# Altium project EM-Lite.PrjPcb
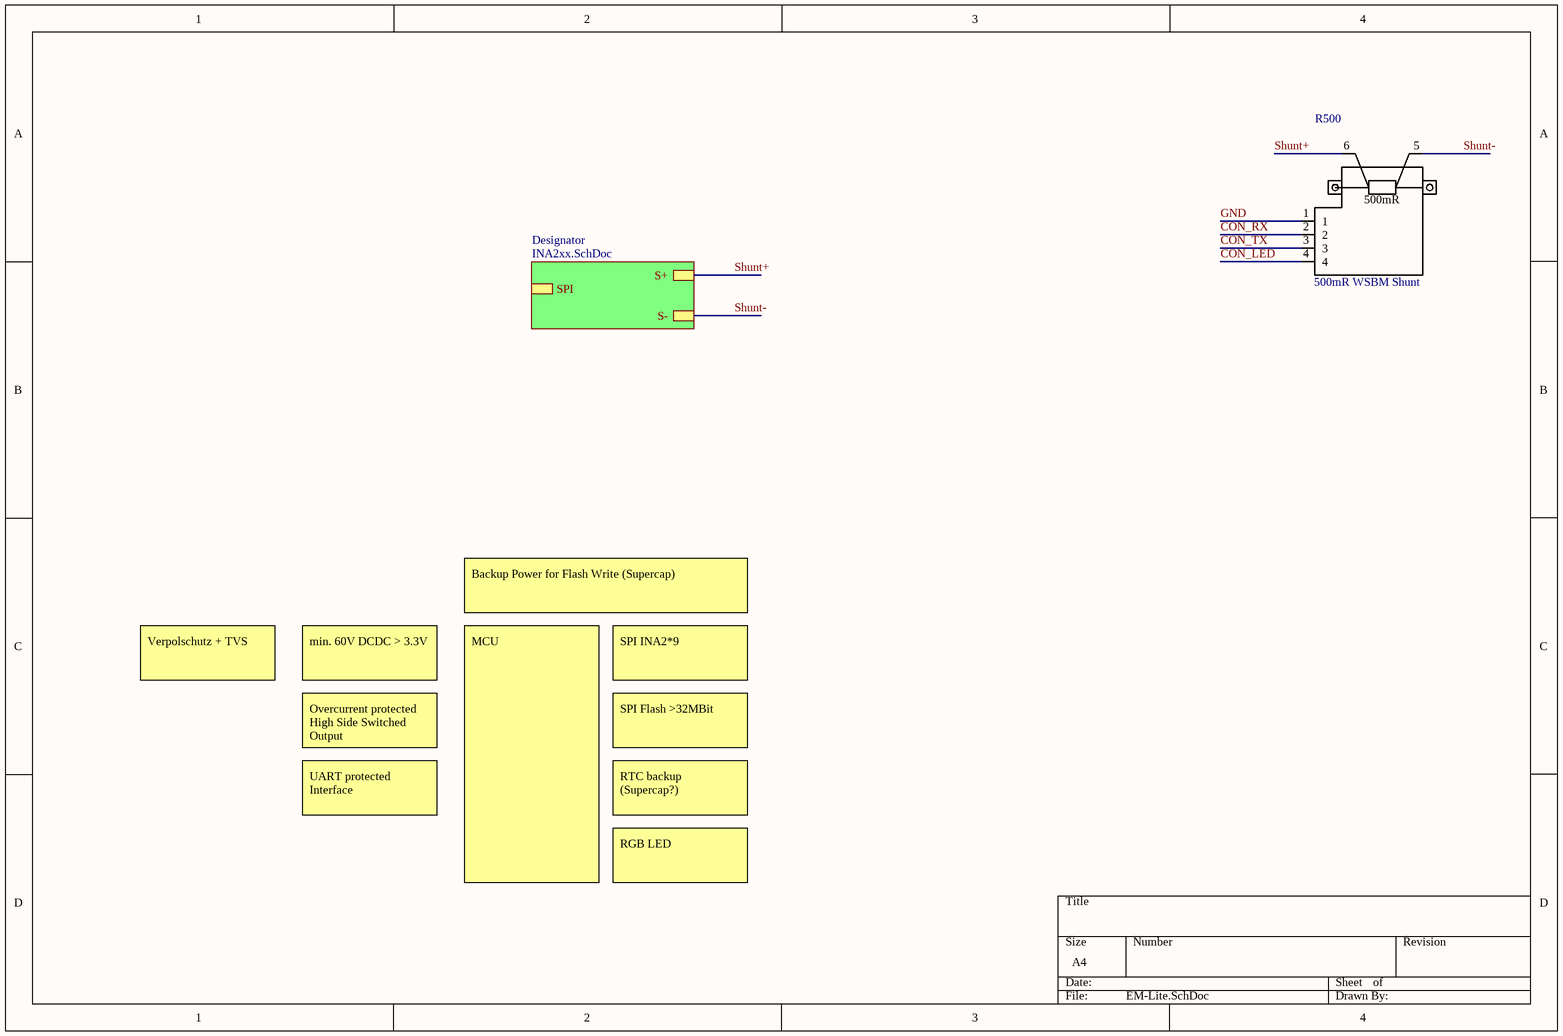
[diagram p0: EM-Lite.SchDoc]
2 sheets, 2 parts. Net scope: hierarchical (ports join the sheet entries above them; power ports are global).
Board file: EM-Lite.PcbDoc
Sheets:
  EM-Lite.SchDoc
    Designator = INA2xx.SchDoc

## Sheet EM-Lite.SchDoc
size A4

### Parts
R500  500mR WSBM Shunt  [500mR]

### Sub-sheets
Designator = INA2xx.SchDoc: S+, SPI (harness SPI), S-

### Nets
CON_LED: R500.4
CON_RX: R500.2
CON_TX: R500.3
GND: R500.1
Shunt+: R500.6 ; sheet Designator/S+  [project net S+]
Shunt-: R500.5 ; sheet Designator/S-  [project net S-]

### Notes on the sheet
- Backup Power for Flash Write (Supercap)
- Verpolschutz + TVS
- min. 60V DCDC > 3.3V
- SPI INA2*9
- Overcurrent protected High Side Switched Output
- SPI Flash >32MBit
- UART protected Interface
- RTC backup (Supercap?)
- MCU
- RGB LED
- (in symbol Shunt_500mR) 500mR

### Library data of the parts
R500 = Shunt_500mR: Power Metal Strip® Battery Shunt Resistor W/Molded Enclosure / Very Low Value (50 μR, 100 μR, 125 μR, and 500 μR); Manufacturer: Vishay; Manufacturer Part Number: WSBM8518L5000

## Sheet INA2xx.SchDoc
size A4
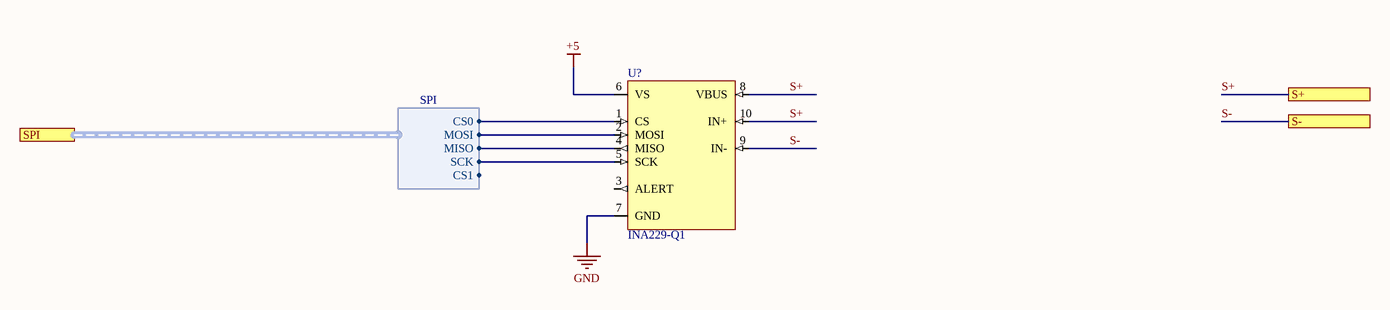
[diagram p1: INA2xx.SchDoc]

### Parts
U?  INA229-Q1  [VSSOP10]

### Ports
S+, S-, SPI (harness SPI)

### Harnesses
SPI: MOSI, MISO, SCK, CS0, CS1

### Nets
+5: U?.6(VS)
GND: U?.7(GND)
S+: U?.8(VBUS) U?.10(IN+) ; port S+
S-: U?.9(IN-) ; port S-
NetU?_1: U?.1(CS) ; port SPI.CS0
NetU?_2: U?.2(MOSI) ; port SPI.MOSI
NetU?_4: U?.4(MISO) ; port SPI.MISO
NetU?_5: U?.5(SCK) ; port SPI.SCK

Not connected (* = marked no-connect by the designer): U? 3(ALERT)

### Library data of the parts
U? = INA229: 85-V, 20-Bit, Ultra-Precise Power/Energy/Charge Monitor With SPI Interface; Manufacturer: Texas Instruments; Manufacturer Part Number: INA229AQDGSRQ1

## Nets that join several sheets
S+: EM-Lite (R500.6), INA2xx (U?.8 U?.10)
S-: EM-Lite (R500.5), INA2xx (U?.9)